# Altium schematic sheet STM32F030.SchDoc
size A4; SheetNumber: 1; SheetTotal: 1
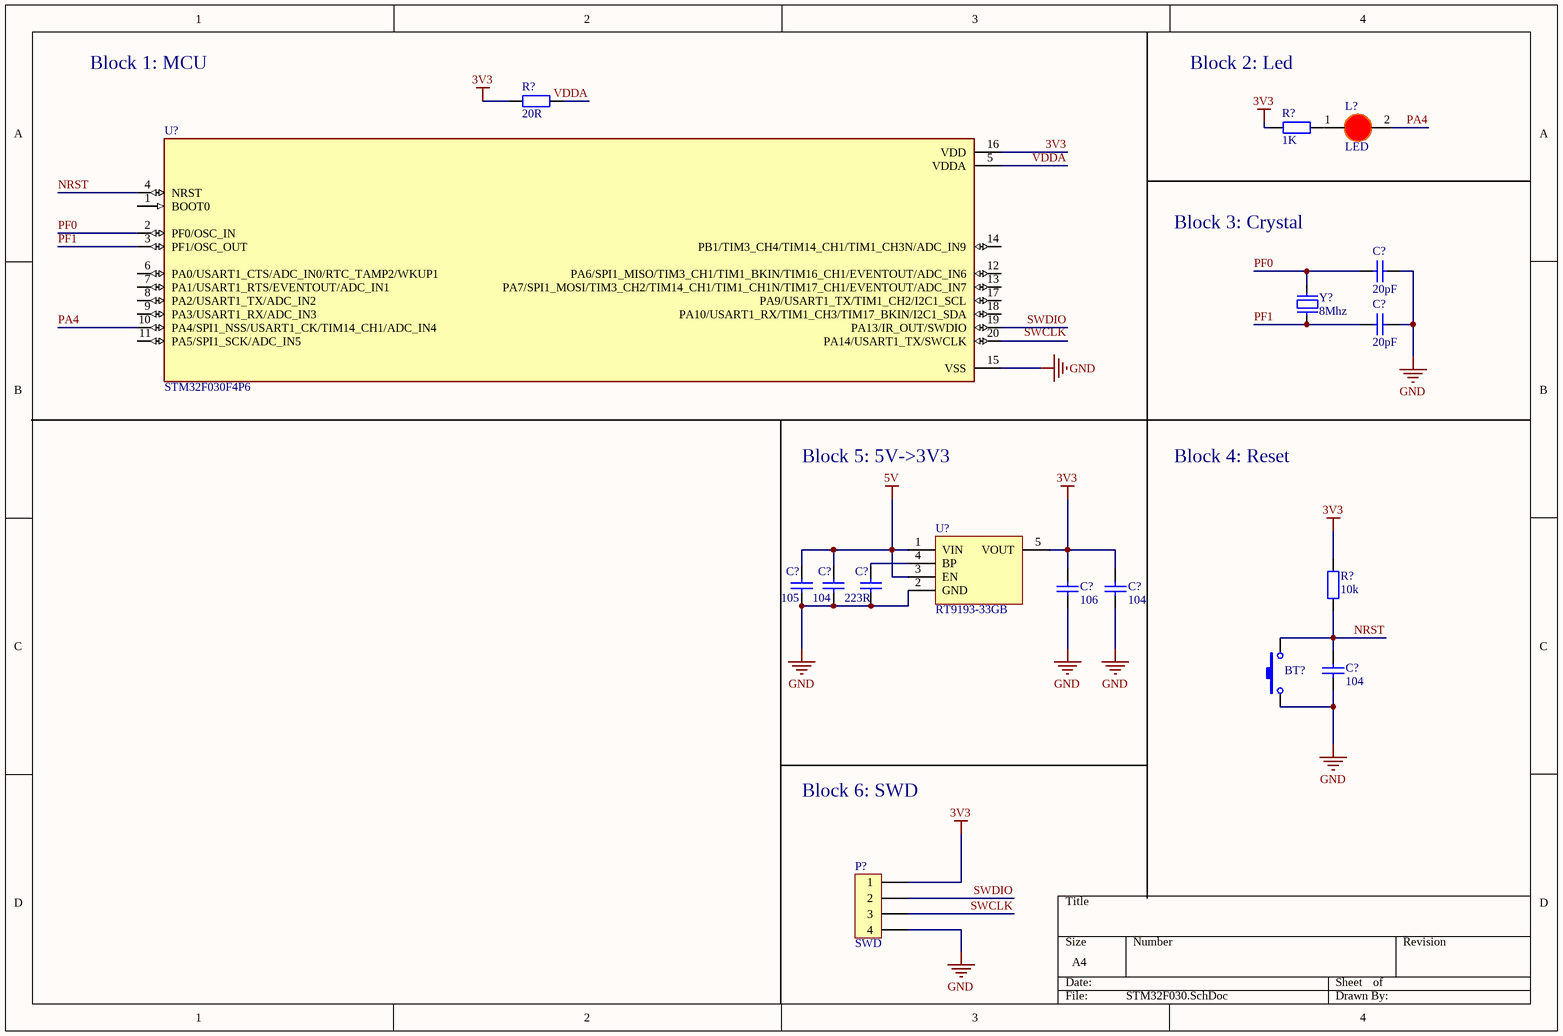
[diagram p0: STM32F030.SchDoc]

## Parts
(Parts that share a designator on the sheet are numbered #1, #2 ... from top to bottom, then left to right.)
BT?  Nut Nhan 2 Chan SMD 3x6x2.5  [Nut Nhan 2 Chan SMD 3x6x2.5]  (value not drawn)
C?#1  20pF  [tu 0603]
C?#2  20pF  [tu 0603]
C?#3  105  [tu 0805]
C?#4  104  [tu 0603]
C?#5  223R  [tu 0603]
C?#6  104  [tu 0603]
C?#7  106  [tu 0805]
C?#8  104  [tu 0603]
L?  LED  [LED-0805-Red]
P?  SWD  [header4p_90]
R?#1  20R  [tro smd 0603]
R?#2  1K  [tro smd 0603]
R?#3  10k  [tro smd 0603]
U?#1  STM32F030F4P6  [SOP65P640X120-20N]
U?#2  RT9193-33GB  [SOT23-5]
Y?  8Mhz  [Thach Anh 2 Chan 32,768 KHz]

## Nets
3V3: C?#6.1 C?#7.1 P?.1 R?#1.1 R?#2.1 R?#3.2 U?#1.16(VDD) U?#2.5(VOUT)
5V: C?#3.1 C?#4.1 U?#2.1(VIN) U?#2.3(EN)
GND: BT?.1 C?#1.1 C?#2.1 C?#3.2 C?#4.2 C?#5.2 C?#6.2 C?#7.2 C?#8.2 P?.4 U?#1.15(VSS) U?#2.2(GND)
NRST: BT?.2 C?#8.1 R?#3.1 U?#1.4(NRST)
PA4: L?.2(K) U?#1.10(PA4/SPI1_NSS/USART1_CK/TIM14_CH1/ADC_IN4)
PF0: C?#1.2 U?#1.2(PF0/OSC_IN) Y?.2
PF1: C?#2.2 U?#1.3(PF1/OSC_OUT) Y?.1
SWCLK: P?.3
SWDIO: P?.2 U?#1.19(PA13/IR_OUT/SWDIO)
VDDA: R?#1.2 U?#1.5(VDDA)
NetC?#5_1: C?#5.1 U?#2.4(BP)
NetL?_1: L?.1(A) R?#2.2

Not connected (* = marked no-connect by the designer): U?#1 1(BOOT0) 6(PA0/USART1_CTS/ADC_IN0/RTC_TAMP2/WKUP1) 7(PA1/USART1_RTS/EVENTOUT/ADC_IN1) 8(PA2/USART1_TX/ADC_IN2) 9(PA3/USART1_RX/ADC_IN3) 11(PA5/SPI1_SCK/ADC_IN5) 12(PA6/SPI1_MISO/TIM3_CH1/TIM1_BKIN/TIM16_CH1/EVENTOUT/ADC_IN6) 13(PA7/SPI1_MOSI/TIM3_CH2/TIM14_CH1/TIM1_CH1N/TIM17_CH1/EVENTOUT/ADC_IN7) 14(PB1/TIM3_CH4/TIM14_CH1/TIM1_CH3N/ADC_IN9) 17(PA9/USART1_TX/TIM1_CH2/I2C1_SCL) 18(PA10/USART1_RX/TIM1_CH3/TIM17_BKIN/I2C1_SDA) 20(PA14/USART1_TX/SWCLK)

## Notes on the sheet
- Block 1: MCU
- Block 2: Led
- Block 3: Crystal
- Block 5: 5V->3V3
- Block 4: Reset
- Block 6: SWD
- Labels drawn without touching a wire or pin: SWCLK

## Library data of the parts
BT? = Nut Nhan 2 Chan SMD 3x6x2.5: Ma_Hang: MH001036; Ten: Nút Nhấn 2 Chân 3x6x2.5MM SMD
C?#1 C?#2 C?#4-C?#6 C?#8 = Tu 0603 22pF 50V 10%: Dán; Don_Vi: Con; So_Chan: 2; Ten_Linh_Kien: Tụ 0603 22pF 50V 10%; Ma_Hang: MH004570; Chung_Loai: Dán; Kieu_Chan: *
C?#3 C?#7 = Tu 0805 106 16V 10%: Dán; Ten_Linh_Kien: Tụ 0805 106-10uF 10% 16V; So_Chan: 2; Don_Vi: Con; Ma_Hang: MH004553; Chung_Loai: Dán; Kieu_Chan: *
L? = LED 0805 Do: Dán; Don_Vi: Con; Ma_Hang: MH000897; Ten_Linh_Kien: LED 0805 Màu Đỏ (Red); Ghi_Chu: *; Kieu_Chan: *; Chung_Loai: Dán
P? = header4p_90
R?#1 R?#2 = Tro 0603 1% 1k: Dán; So_Chan: 2; Don_Vi: Con; Ten_Linh_Kien: Trở 0603 1% 1k; Ma_Hang: MH006334; Chung_Loai: Dán; Kieu_Chan: *
R?#3 = Tro 0603 1% 10k: Dán; Don_Vi: Con; So_Chan: 2; Ten_Linh_Kien: Trở 0603 1% 10k; Ma_Hang: MH006333; Chung_Loai: Dán; Kieu_Chan: *
U?#1 = STM32F030F4P6: MCU 32-bit STM32F ARM Cortex M0 RISC 16KB Flash 2.5V/3.3V 20-Pin TSSOP Tray; Value: *; Availability: Unavailable; Price: None; MP: STM32F030F4P6; Package: None
U?#2 = REG_5.5V-3.3V-0.3A-1W-SOT-23-5: Linear Voltage Regulator IC 1 Output 300mA SOT-23-5; Manufacturer: Richtek USA Inc.; Alternate Part Number-1: NA; Manufacturer Part Number: RT9193-33GB; Supplier-1: LCSC; Supplier Part Number-1: C15651; Case/Package: SOT-23-5
Y? = Thach Anh 2 chan 32,768 Khz: Crystal For all Crystal 2pin.; Value: 4Mhz